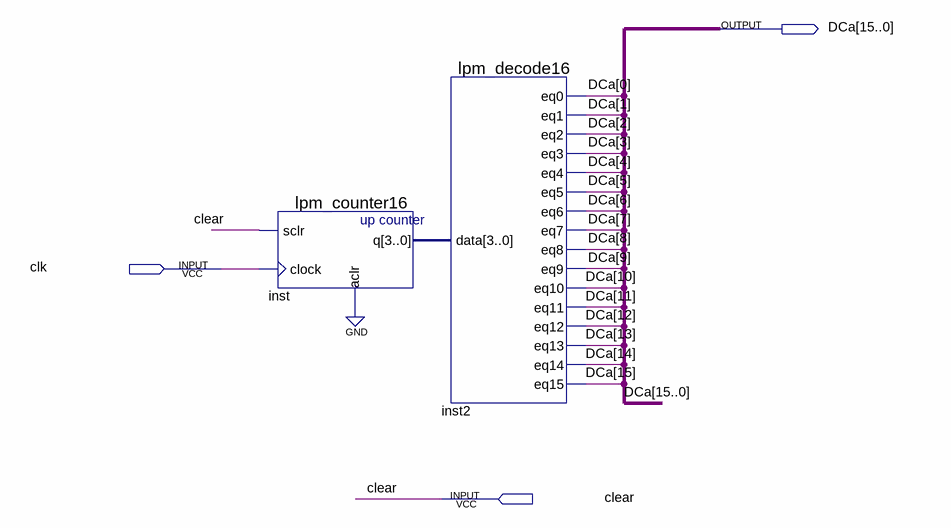
[diagram p0: schematic sheet]
// Quartus schematic DCa.bdf as structural Verilog: 2 symbols, 3 pins
module DCa (
  input  clk,
  input  clear,
  output [15:0] DCa
);

  wire [3:0] inst_q;

  lpm_counter16 inst (.sclr(clear), .clock(clk), .aclr(1'b0), .q(inst_q));
  lpm_decode16 inst2 (
    .data(inst_q), .eq0(DCa[0]), .eq1(DCa[1]), .eq2(DCa[2]), .eq3(DCa[3]), .eq4(DCa[4]), .eq5(DCa[5]),
    .eq6(DCa[6]), .eq7(DCa[7]), .eq8(DCa[8]), .eq9(DCa[9]), .eq10(DCa[10]), .eq11(DCa[11]), .eq12(DCa[12]),
    .eq13(DCa[13]), .eq14(DCa[14]), .eq15(DCa[15]));
endmodule
